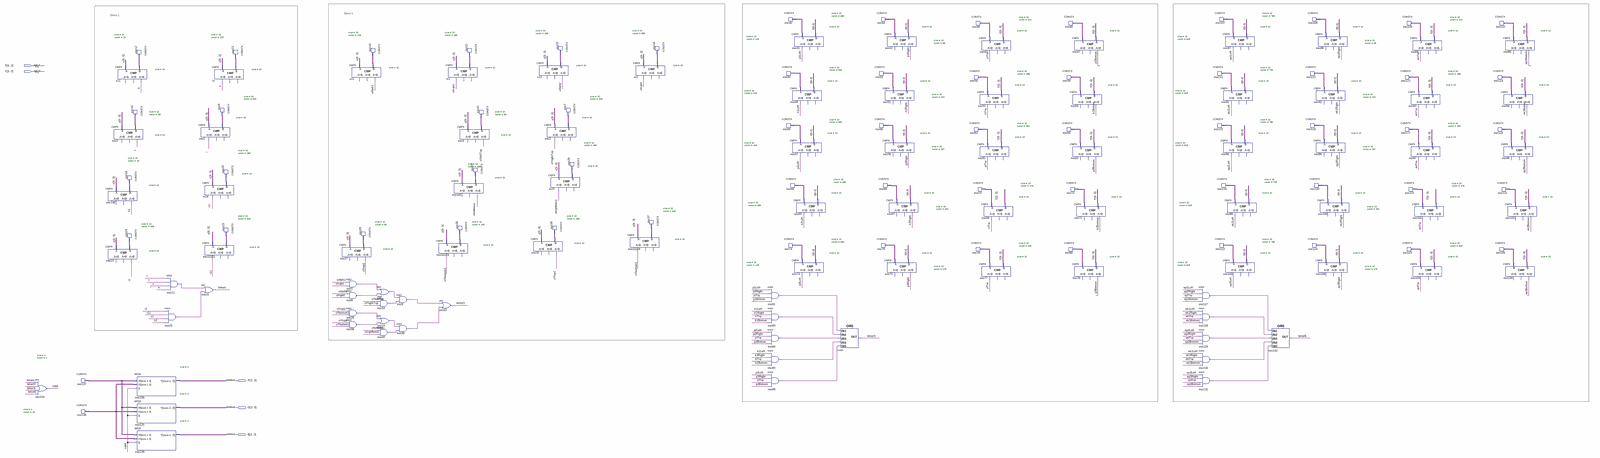
[diagram p0: schematic sheet, whole]
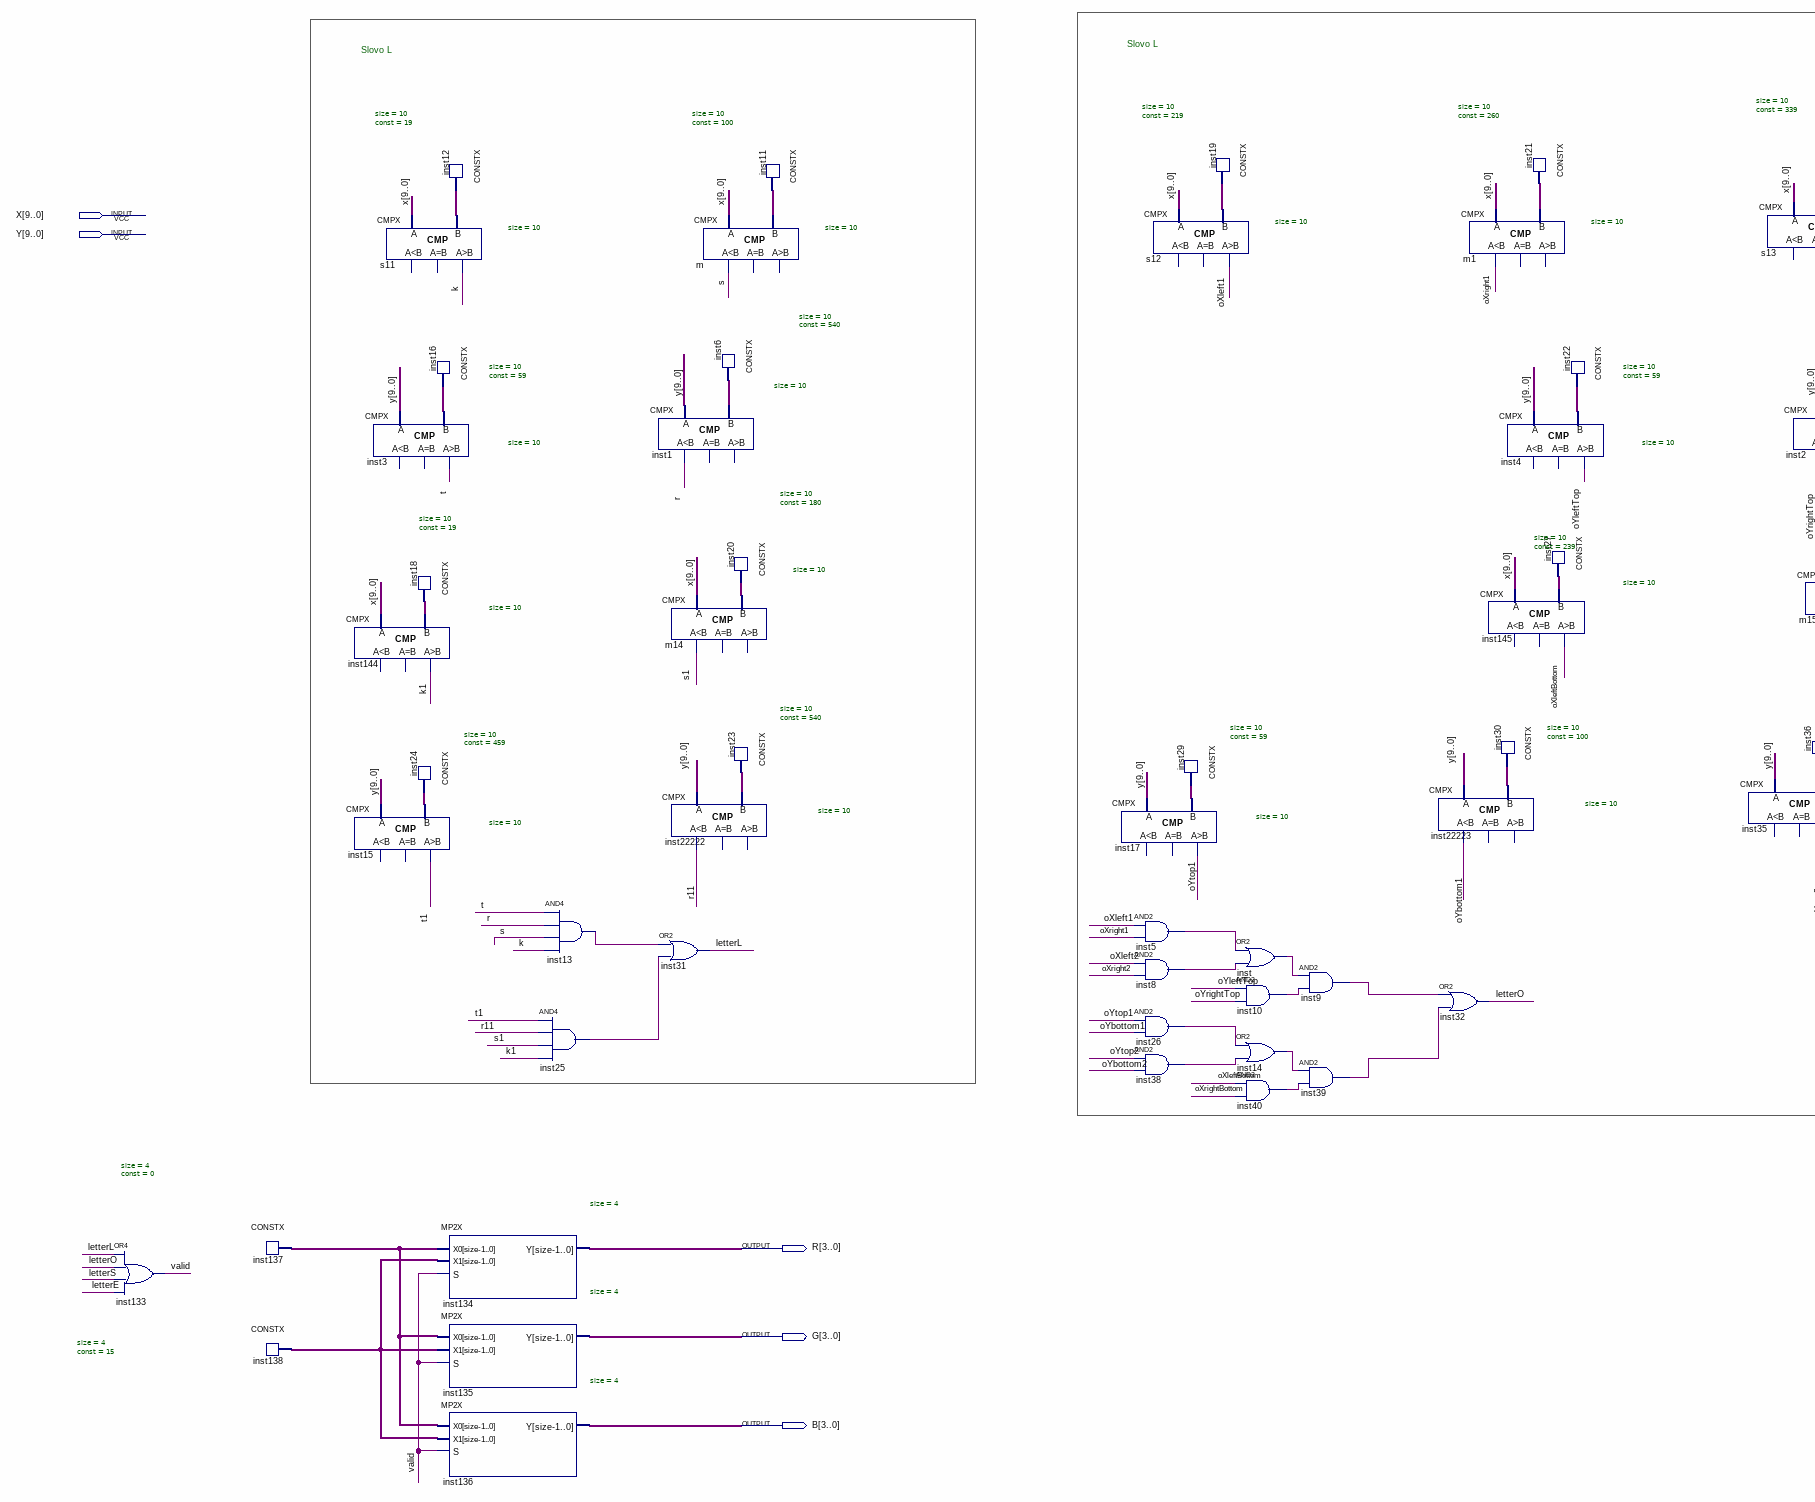
[diagram p1: schematic sheet, left part]
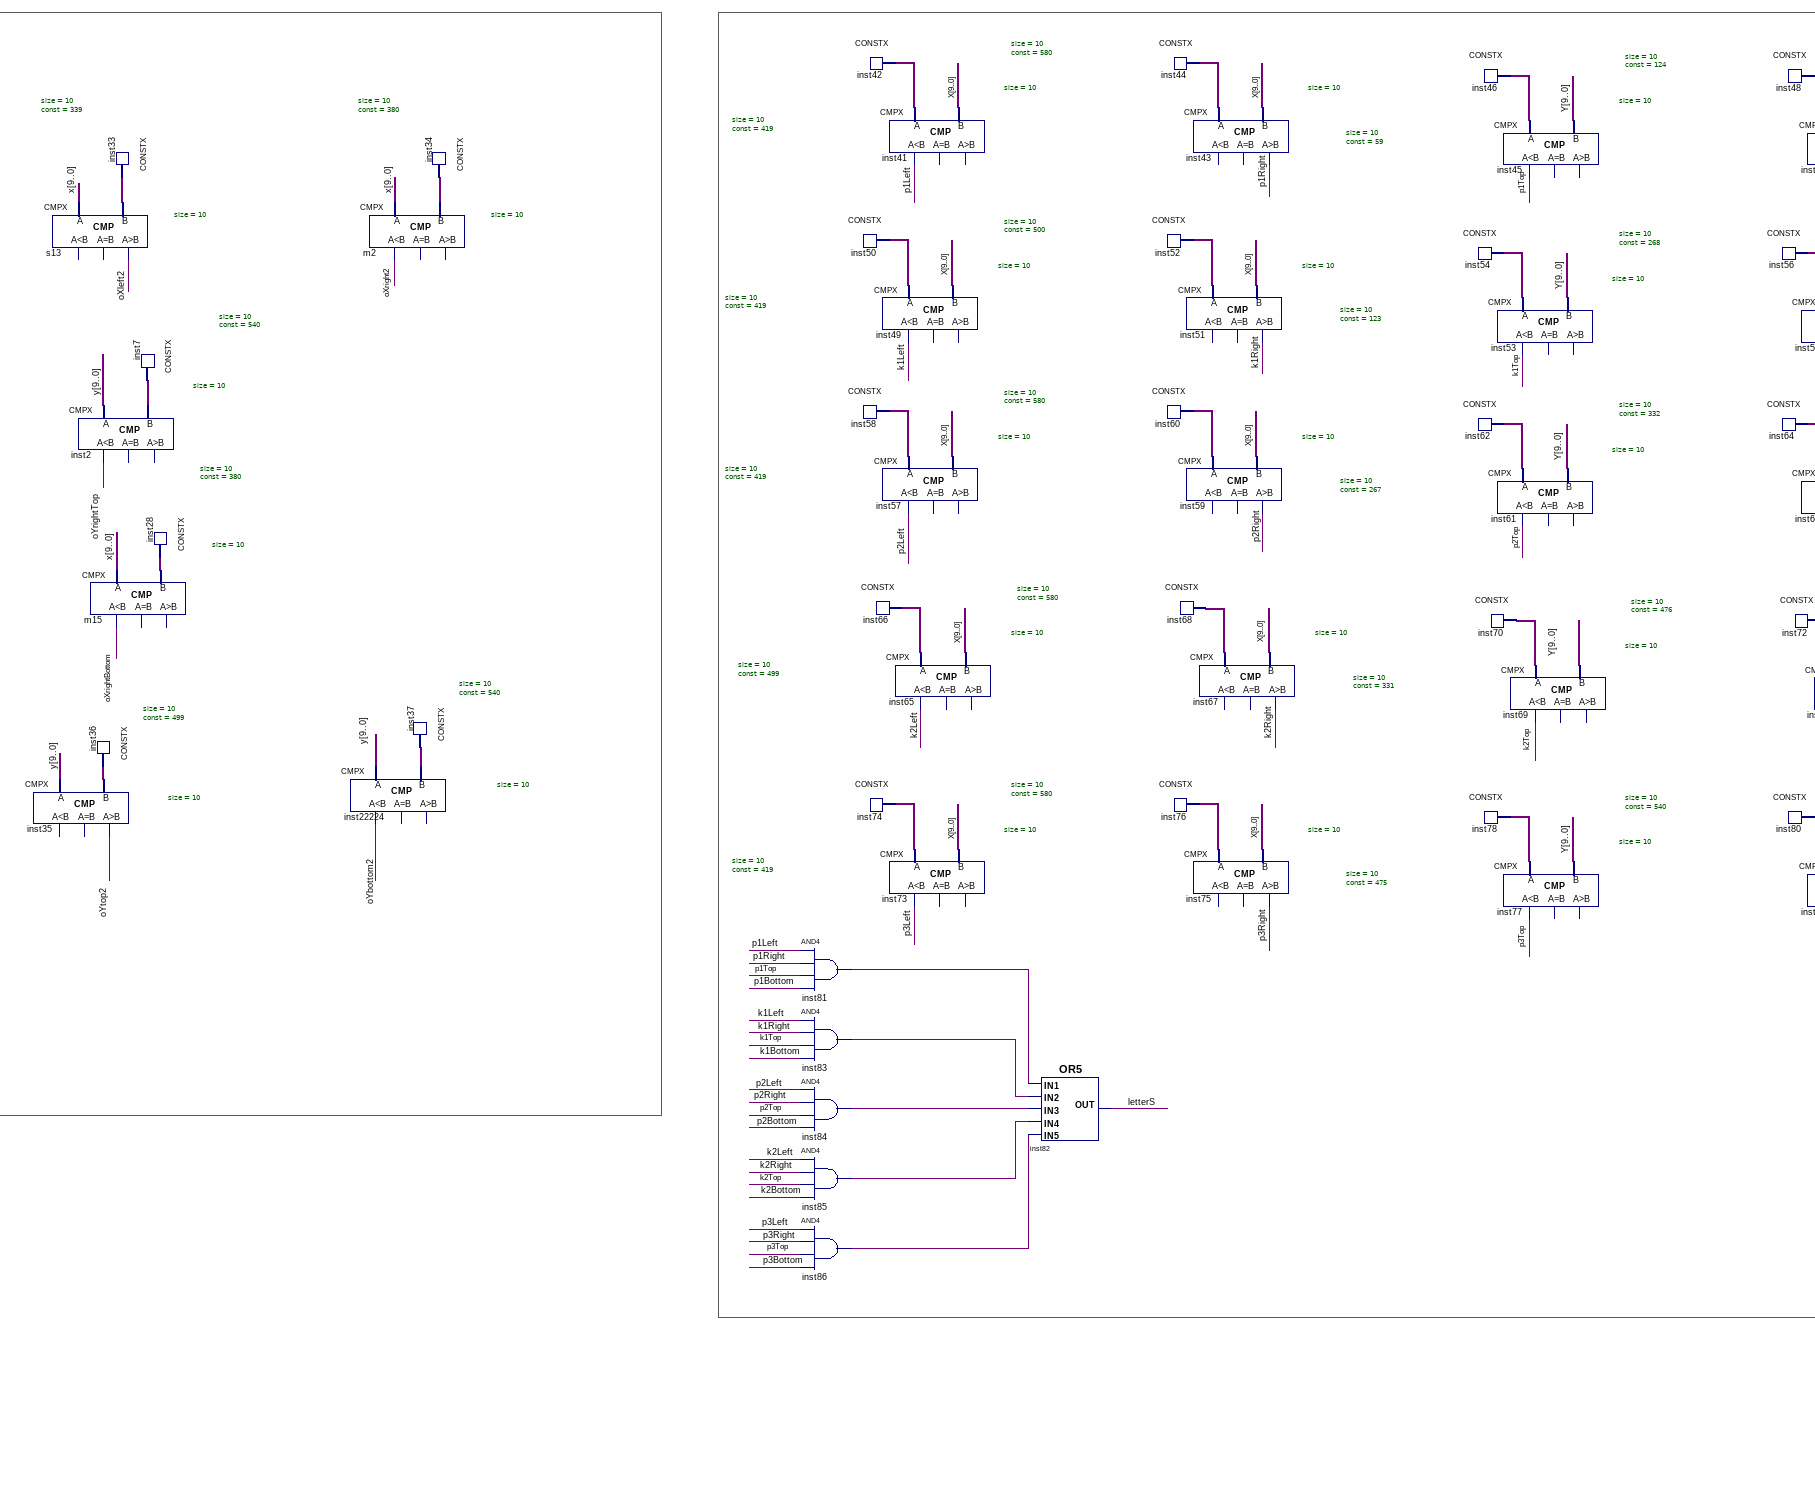
[diagram p2: schematic sheet, centre part]
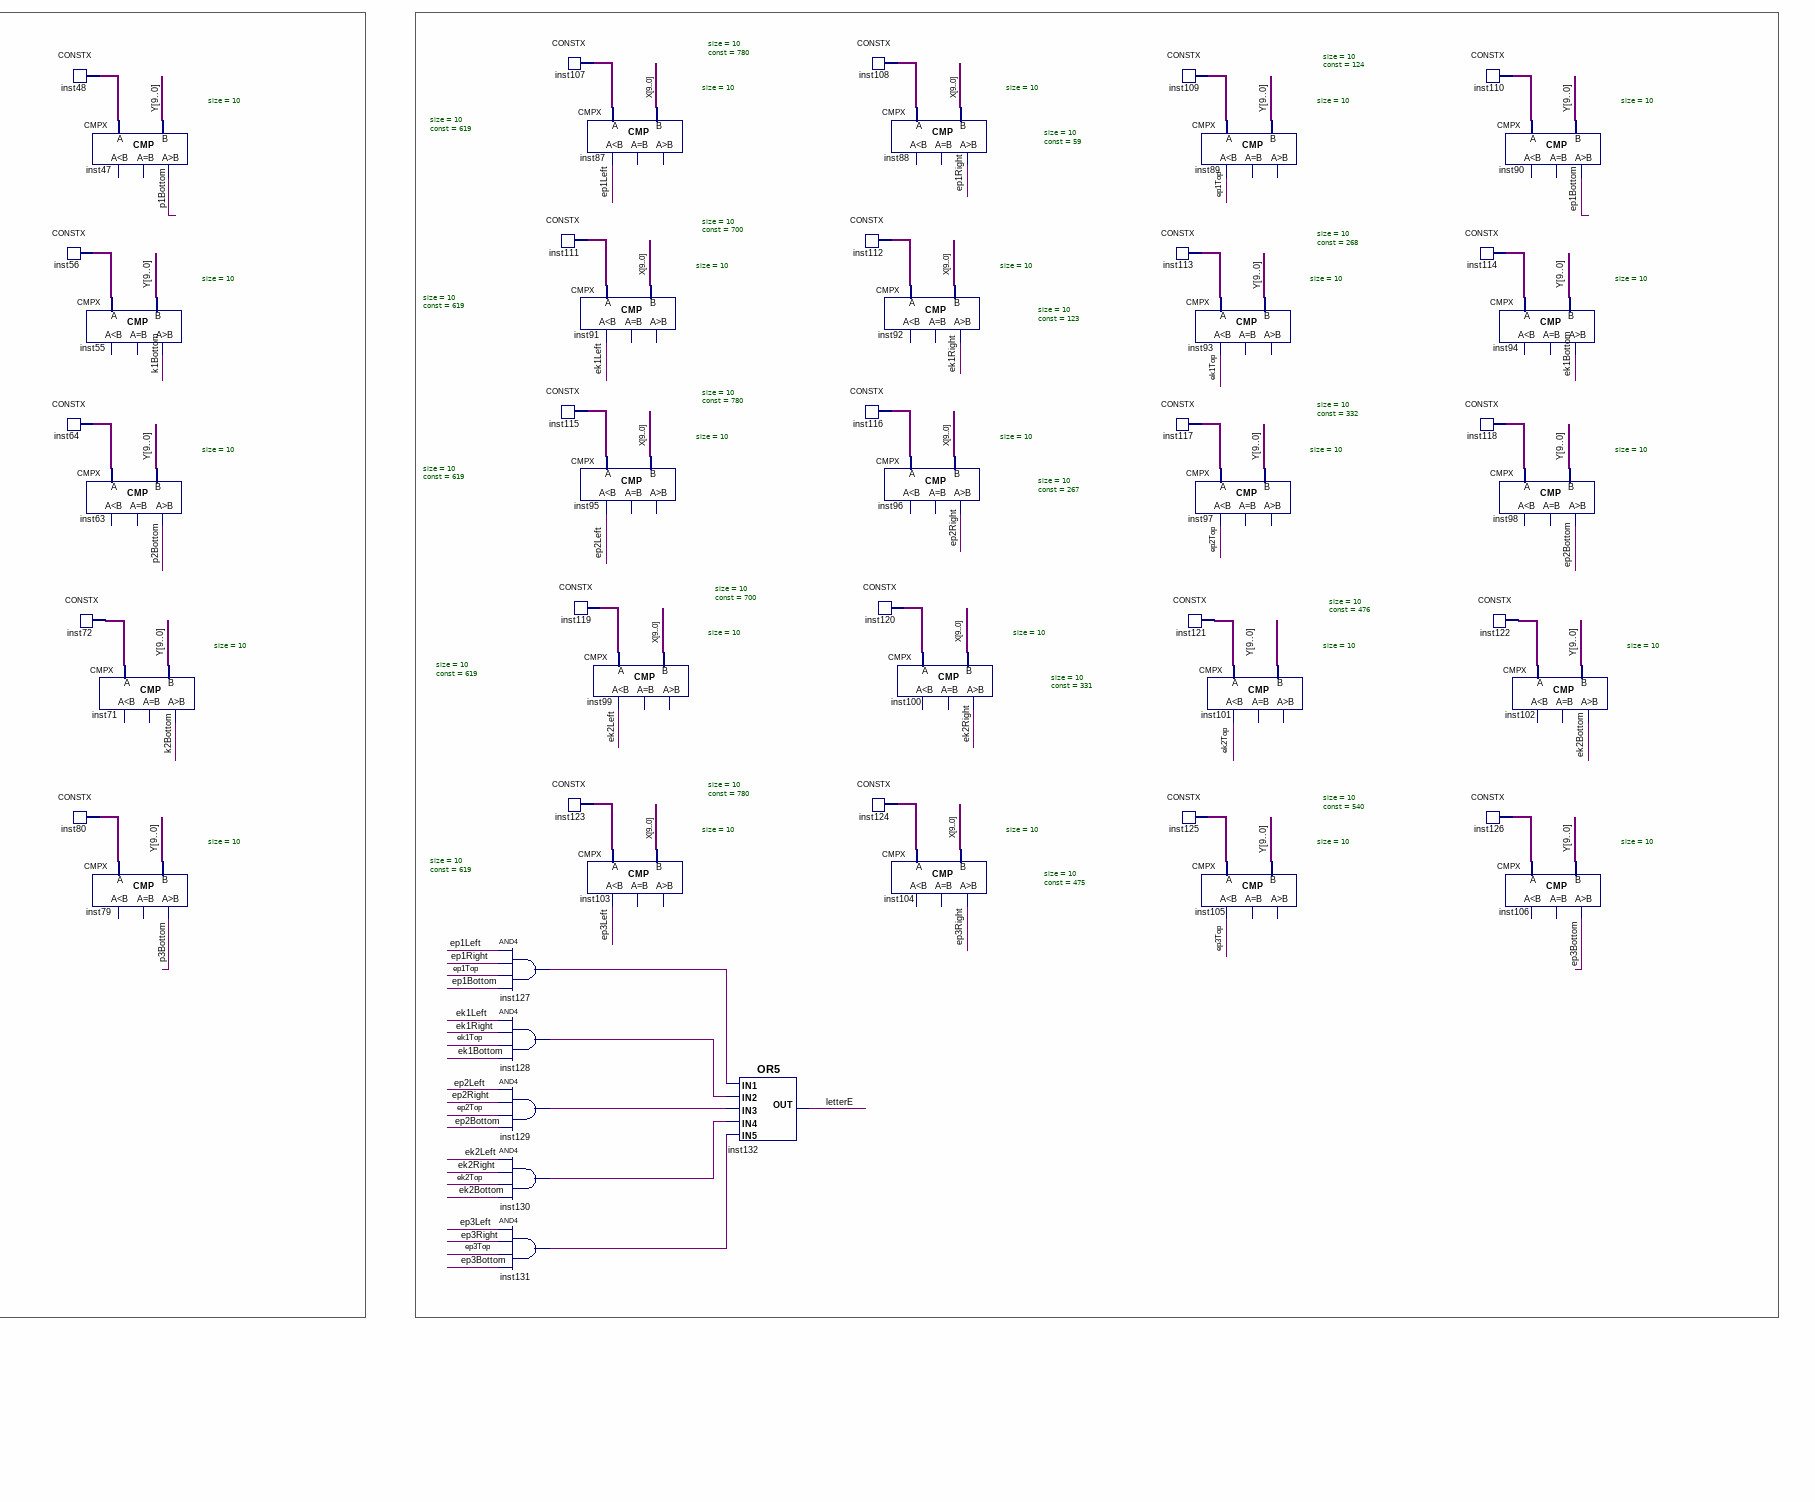
[diagram p3: schematic sheet, right part]
// Quartus schematic Lose.bdf as structural Verilog: 152 symbols, 5 pins
module Lose (
  input  [9:0] X,
  input  [9:0] Y,
  output [3:0] R,
  output [3:0] G,
  output [3:0] B
);

  wire ek1Bottom, ek1Left, ek1Right, ek1Top, ek2Bottom, ek2Left, ek2Right, ek2Top, ep1Bottom, ep1Left,
       ep1Right, ep1Top, ep2Bottom, ep2Left, ep2Right, ep2Top, ep3Bottom, ep3Left, ep3Right, ep3Top,
       inst5_out, inst8_out, inst9_out, inst10_out, inst13_out, inst14_out, inst25_out, inst26_out,
       inst38_out, inst39_out, inst40_out, inst81_out, inst83_out, inst84_out, inst85_out, inst86_out,
       inst127_out, inst128_out, inst129_out, inst130_out, inst131_out, inst_out, k, k1, k1Bottom, k1Left,
       k1Right, k1Top, k2Bottom, k2Left, k2Right, k2Top, letterE, letterL, letterO, letterS, oXleft1,
       oXleft2, oXleftBottom, oXright1, oXright2, oXrightBottom, oYbottom1, oYbottom2, oYleftTop, oYrightTop,
       oYtop1, oYtop2, p1Bottom, p1Left, p1Right, p1Top, p2Bottom, p2Left, p2Right, p2Top, p3Bottom, p3Left,
       p3Right, p3Top, r11, R_1bit, s, s1, t, t1, valid;
  wire [3:0] inst137_data, inst138_data;
  wire [9:0] inst6_data, inst7_data, inst11_data, inst12_data, inst16_data, inst18_data, inst19_data,
       inst20_data, inst21_data, inst22_data, inst23_data, inst24_data, inst27_data, inst28_data,
       inst29_data, inst30_data, inst33_data, inst34_data, inst36_data, inst37_data, inst42_data,
       inst44_data, inst46_data, inst48_data, inst50_data, inst52_data, inst54_data, inst56_data,
       inst58_data, inst60_data, inst62_data, inst64_data, inst66_data, inst68_data, inst70_data,
       inst72_data, inst74_data, inst76_data, inst78_data, inst80_data, inst107_data, inst108_data,
       inst109_data, inst110_data, inst111_data, inst112_data, inst113_data, inst114_data, inst115_data,
       inst116_data, inst117_data, inst118_data, inst119_data, inst120_data, inst121_data, inst122_data,
       inst123_data, inst124_data, inst125_data, inst126_data;

  or inst133 (valid, letterL, letterO, letterS, letterE);
  CONSTX #(.size(4), .\const (0)) inst137 (.data(inst137_data));
  CONSTX #(.size(4), .\const (15)) inst138 (.data(inst138_data));
  CMPX #(.size(10)) inst3 (.A(Y), .B(inst16_data), .gr(t));  // open: ls, eq
  CMPX #(.size(10)) inst144 (.A(X), .B(inst18_data), .gr(k1));  // open: ls, eq
  CMPX #(.size(10)) inst15 (.A(Y), .B(inst24_data), .gr(t1));  // open: ls, eq
  CMPX #(.size(10)) s11 (.A(X), .B(inst12_data), .gr(k));  // open: ls, eq
  CONSTX #(.size(10), .\const (19)) inst18 (.data(inst18_data));
  CONSTX #(.size(10), .\const (459)) inst24 (.data(inst24_data));
  CONSTX #(.size(10), .\const (19)) inst12 (.data(inst12_data));
  CONSTX #(.size(10), .\const (59)) inst16 (.data(inst16_data));
  MP2X #(.size(4)) inst134 (.X0(inst137_data), .X1(inst138_data), .S(valid), .Y(R));
  MP2X #(.size(4)) inst135 (.X0(inst137_data), .X1(inst138_data), .S(valid), .Y(G));
  MP2X #(.size(4)) inst136 (.X0(inst137_data), .X1(inst138_data), .S(valid), .Y(B));
  and inst13 (inst13_out, t, R_1bit, s, k);
  and inst25 (inst25_out, t1, r11, s1, k1);
  CMPX #(.size(10)) inst1 (.A(Y), .B(inst6_data), .ls(R_1bit));  // open: eq, gr
  CMPX #(.size(10)) m14 (.A(X), .B(inst20_data), .ls(s1));  // open: eq, gr
  CMPX #(.size(10)) inst22222 (.A(Y), .B(inst23_data), .ls(r11));  // open: eq, gr
  or inst31 (letterL, inst13_out, inst25_out);
  CMPX #(.size(10)) m (.A(X), .B(inst11_data), .ls(s));  // open: eq, gr
  CONSTX #(.size(10), .\const (540)) inst6 (.data(inst6_data));
  CONSTX #(.size(10), .\const (100)) inst11 (.data(inst11_data));
  CONSTX #(.size(10), .\const (180)) inst20 (.data(inst20_data));
  CONSTX #(.size(10), .\const (540)) inst23 (.data(inst23_data));
  CMPX #(.size(10)) inst17 (.A(Y), .B(inst29_data), .gr(oYtop1));  // open: ls, eq
  CMPX #(.size(10)) s12 (.A(X), .B(inst19_data), .gr(oXleft1));  // open: ls, eq
  CONSTX #(.size(10), .\const (59)) inst29 (.data(inst29_data));
  and inst5 (inst5_out, oXleft1, oXright1);
  and inst8 (inst8_out, oXleft2, oXright2);
  and inst26 (inst26_out, oYtop1, oYbottom1);
  and inst38 (inst38_out, oYtop2, oYbottom2);
  CONSTX #(.size(10), .\const (219)) inst19 (.data(inst19_data));
  or inst (inst_out, inst5_out, inst8_out);
  and inst10 (inst10_out, oYleftTop, oYrightTop);
  or inst14 (inst14_out, inst26_out, inst38_out);
  and inst40 (inst40_out, oXleftBottom, oXrightBottom);
  and inst9 (inst9_out, inst_out, inst10_out);
  and inst39 (inst39_out, inst14_out, inst40_out);
  CMPX #(.size(10)) inst22223 (.A(Y), .B(inst30_data), .ls(oYbottom1));  // open: eq, gr
  CMPX #(.size(10)) m1 (.A(X), .B(inst21_data), .ls(oXright1));  // open: eq, gr
  CMPX #(.size(10)) inst145 (.A(X), .B(inst27_data), .gr(oXleftBottom));  // open: ls, eq
  or inst32 (letterO, inst9_out, inst39_out);
  CONSTX #(.size(10), .\const (260)) inst21 (.data(inst21_data));
  CMPX #(.size(10)) inst4 (.A(Y), .B(inst22_data), .gr(oYleftTop));  // open: ls, eq
  CONSTX #(.size(10), .\const (100)) inst30 (.data(inst30_data));
  CONSTX #(.size(10), .\const (59)) inst22 (.data(inst22_data));
  CONSTX #(.size(10), .\const (239)) inst27 (.data(inst27_data));
  CMPX #(.size(10)) s13 (.A(X), .B(inst33_data), .gr(oXleft2));  // open: ls, eq
  CMPX #(.size(10)) inst2 (.A(Y), .B(inst7_data), .ls(oYrightTop));  // open: eq, gr
  CMPX #(.size(10)) inst35 (.A(Y), .B(inst36_data), .gr(oYtop2));  // open: ls, eq
  CONSTX #(.size(10), .\const (339)) inst33 (.data(inst33_data));
  CMPX #(.size(10)) m15 (.A(X), .B(inst28_data), .ls(oXrightBottom));  // open: eq, gr
  CONSTX #(.size(10), .\const (499)) inst36 (.data(inst36_data));
  CONSTX #(.size(10), .\const (540)) inst7 (.data(inst7_data));
  CONSTX #(.size(10), .\const (380)) inst28 (.data(inst28_data));
  CMPX #(.size(10)) m2 (.A(X), .B(inst34_data), .ls(oXright2));  // open: eq, gr
  CMPX #(.size(10)) inst22224 (.A(Y), .B(inst37_data), .ls(oYbottom2));  // open: eq, gr
  CONSTX #(.size(10), .\const (380)) inst34 (.data(inst34_data));
  CONSTX #(.size(10), .\const (540)) inst37 (.data(inst37_data));
  and inst81 (inst81_out, p1Left, p1Right, p1Top, p1Bottom);
  and inst83 (inst83_out, k1Left, k1Right, k1Top, k1Bottom);
  and inst84 (inst84_out, p2Left, p2Right, p2Top, p2Bottom);
  and inst85 (inst85_out, k2Left, k2Right, k2Top, k2Bottom);
  and inst86 (inst86_out, p3Left, p3Right, p3Top, p3Bottom);
  CONSTX #(.size(10), .\const (419)) inst42 (.data(inst42_data));
  CMPX #(.size(10)) inst41 (.A(inst42_data), .B(X), .ls(p1Left));  // open: eq, gr
  CONSTX #(.size(10), .\const (419)) inst50 (.data(inst50_data));
  CMPX #(.size(10)) inst49 (.A(inst50_data), .B(X), .ls(k1Left));  // open: eq, gr
  CONSTX #(.size(10), .\const (419)) inst58 (.data(inst58_data));
  CMPX #(.size(10)) inst57 (.A(inst58_data), .B(X), .ls(p2Left));  // open: eq, gr
  CONSTX #(.size(10), .\const (499)) inst66 (.data(inst66_data));
  CONSTX #(.size(10), .\const (419)) inst74 (.data(inst74_data));
  CMPX #(.size(10)) inst73 (.A(inst74_data), .B(X), .ls(p3Left));  // open: eq, gr
  CMPX #(.size(10)) inst65 (.A(inst66_data), .B(X), .ls(k2Left));  // open: eq, gr
  or inst82 (letterS, inst81_out, inst83_out, inst84_out, inst85_out, inst86_out);
  CONSTX #(.size(10), .\const (580)) inst44 (.data(inst44_data));
  CMPX #(.size(10)) inst43 (.A(inst44_data), .B(X), .gr(p1Right));  // open: ls, eq
  CONSTX #(.size(10), .\const (500)) inst52 (.data(inst52_data));
  CMPX #(.size(10)) inst51 (.A(inst52_data), .B(X), .gr(k1Right));  // open: ls, eq
  CONSTX #(.size(10), .\const (580)) inst60 (.data(inst60_data));
  CMPX #(.size(10)) inst59 (.A(inst60_data), .B(X), .gr(p2Right));  // open: ls, eq
  CONSTX #(.size(10), .\const (580)) inst68 (.data(inst68_data));
  CONSTX #(.size(10), .\const (580)) inst76 (.data(inst76_data));
  CMPX #(.size(10)) inst75 (.A(inst76_data), .B(X), .gr(p3Right));  // open: ls, eq
  CMPX #(.size(10)) inst67 (.A(inst68_data), .B(X), .gr(k2Right));  // open: ls, eq
  CONSTX #(.size(10), .\const (59)) inst46 (.data(inst46_data));
  CONSTX #(.size(10), .\const (123)) inst54 (.data(inst54_data));
  CMPX #(.size(10)) inst53 (.A(inst54_data), .B(Y), .ls(k1Top));  // open: eq, gr
  CONSTX #(.size(10), .\const (267)) inst62 (.data(inst62_data));
  CMPX #(.size(10)) inst61 (.A(inst62_data), .B(Y), .ls(p2Top));  // open: eq, gr
  CONSTX #(.size(10), .\const (331)) inst70 (.data(inst70_data));
  CONSTX #(.size(10), .\const (475)) inst78 (.data(inst78_data));
  CMPX #(.size(10)) inst45 (.A(inst46_data), .B(Y), .ls(p1Top));  // open: eq, gr
  CMPX #(.size(10)) inst69 (.A(inst70_data), .B(Y), .ls(k2Top));  // open: eq, gr
  CMPX #(.size(10)) inst77 (.A(inst78_data), .B(Y), .ls(p3Top));  // open: eq, gr
  CONSTX #(.size(10), .\const (124)) inst48 (.data(inst48_data));
  CONSTX #(.size(10), .\const (268)) inst56 (.data(inst56_data));
  CMPX #(.size(10)) inst55 (.A(inst56_data), .B(Y), .gr(k1Bottom));  // open: ls, eq
  CONSTX #(.size(10), .\const (332)) inst64 (.data(inst64_data));
  CMPX #(.size(10)) inst63 (.A(inst64_data), .B(Y), .gr(p2Bottom));  // open: ls, eq
  CONSTX #(.size(10), .\const (476)) inst72 (.data(inst72_data));
  CONSTX #(.size(10), .\const (540)) inst80 (.data(inst80_data));
  CMPX #(.size(10)) inst47 (.A(inst48_data), .B(Y), .gr(p1Bottom));  // open: ls, eq
  CMPX #(.size(10)) inst71 (.A(inst72_data), .B(Y), .gr(k2Bottom));  // open: ls, eq
  CMPX #(.size(10)) inst79 (.A(inst80_data), .B(Y), .gr(p3Bottom));  // open: ls, eq
  and inst127 (inst127_out, ep1Left, ep1Right, ep1Top, ep1Bottom);
  and inst128 (inst128_out, ek1Left, ek1Right, ek1Top, ek1Bottom);
  and inst129 (inst129_out, ep2Left, ep2Right, ep2Top, ep2Bottom);
  and inst130 (inst130_out, ek2Left, ek2Right, ek2Top, ek2Bottom);
  and inst131 (inst131_out, ep3Left, ep3Right, ep3Top, ep3Bottom);
  CONSTX #(.size(10), .\const (619)) inst107 (.data(inst107_data));
  CMPX #(.size(10)) inst87 (.A(inst107_data), .B(X), .ls(ep1Left));  // open: eq, gr
  CONSTX #(.size(10), .\const (619)) inst111 (.data(inst111_data));
  CMPX #(.size(10)) inst91 (.A(inst111_data), .B(X), .ls(ek1Left));  // open: eq, gr
  CONSTX #(.size(10), .\const (619)) inst115 (.data(inst115_data));
  CMPX #(.size(10)) inst95 (.A(inst115_data), .B(X), .ls(ep2Left));  // open: eq, gr
  CONSTX #(.size(10), .\const (619)) inst119 (.data(inst119_data));
  CMPX #(.size(10)) inst99 (.A(inst119_data), .B(X), .ls(ek2Left));  // open: eq, gr
  CONSTX #(.size(10), .\const (619)) inst123 (.data(inst123_data));
  CMPX #(.size(10)) inst103 (.A(inst123_data), .B(X), .ls(ep3Left));  // open: eq, gr
  or inst132 (letterE, inst127_out, inst128_out, inst129_out, inst130_out, inst131_out);
  CONSTX #(.size(10), .\const (780)) inst108 (.data(inst108_data));
  CMPX #(.size(10)) inst88 (.A(inst108_data), .B(X), .gr(ep1Right));  // open: ls, eq
  CONSTX #(.size(10), .\const (700)) inst112 (.data(inst112_data));
  CMPX #(.size(10)) inst92 (.A(inst112_data), .B(X), .gr(ek1Right));  // open: ls, eq
  CONSTX #(.size(10), .\const (780)) inst116 (.data(inst116_data));
  CMPX #(.size(10)) inst96 (.A(inst116_data), .B(X), .gr(ep2Right));  // open: ls, eq
  CONSTX #(.size(10), .\const (700)) inst120 (.data(inst120_data));
  CMPX #(.size(10)) inst100 (.A(inst120_data), .B(X), .gr(ek2Right));  // open: ls, eq
  CONSTX #(.size(10), .\const (780)) inst124 (.data(inst124_data));
  CMPX #(.size(10)) inst104 (.A(inst124_data), .B(X), .gr(ep3Right));  // open: ls, eq
  CONSTX #(.size(10), .\const (59)) inst109 (.data(inst109_data));
  CMPX #(.size(10)) inst89 (.A(inst109_data), .B(Y), .ls(ep1Top));  // open: eq, gr
  CONSTX #(.size(10), .\const (123)) inst113 (.data(inst113_data));
  CMPX #(.size(10)) inst93 (.A(inst113_data), .B(Y), .ls(ek1Top));  // open: eq, gr
  CONSTX #(.size(10), .\const (267)) inst117 (.data(inst117_data));
  CMPX #(.size(10)) inst97 (.A(inst117_data), .B(Y), .ls(ep2Top));  // open: eq, gr
  CONSTX #(.size(10), .\const (331)) inst121 (.data(inst121_data));
  CONSTX #(.size(10), .\const (475)) inst125 (.data(inst125_data));
  CMPX #(.size(10)) inst105 (.A(inst125_data), .B(Y), .ls(ep3Top));  // open: eq, gr
  CMPX #(.size(10)) inst101 (.A(inst121_data), .B(Y), .ls(ek2Top));  // open: eq, gr
  CONSTX #(.size(10), .\const (124)) inst110 (.data(inst110_data));
  CMPX #(.size(10)) inst90 (.A(inst110_data), .B(Y), .gr(ep1Bottom));  // open: ls, eq
  CONSTX #(.size(10), .\const (268)) inst114 (.data(inst114_data));
  CMPX #(.size(10)) inst94 (.A(inst114_data), .B(Y), .gr(ek1Bottom));  // open: ls, eq
  CONSTX #(.size(10), .\const (332)) inst118 (.data(inst118_data));
  CMPX #(.size(10)) inst98 (.A(inst118_data), .B(Y), .gr(ep2Bottom));  // open: ls, eq
  CONSTX #(.size(10), .\const (476)) inst122 (.data(inst122_data));
  CONSTX #(.size(10), .\const (540)) inst126 (.data(inst126_data));
  CMPX #(.size(10)) inst106 (.A(inst126_data), .B(Y), .gr(ep3Bottom));  // open: ls, eq
  CMPX #(.size(10)) inst102 (.A(inst122_data), .B(Y), .gr(ek2Bottom));  // open: ls, eq

  // Notes on the sheet:
  //   Slovo L
  //   Slovo L
endmodule
